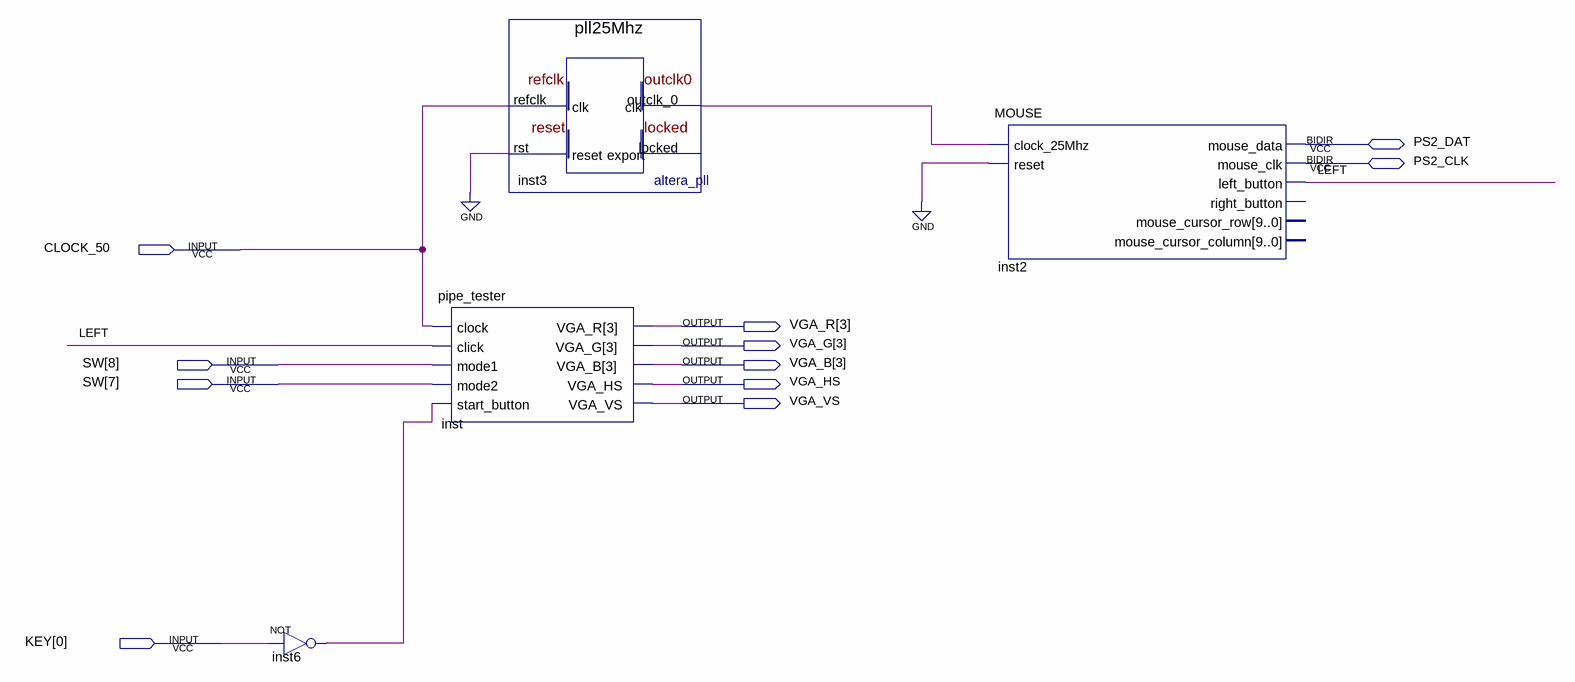
[diagram p0: schematic sheet]
// Quartus schematic test_playing.bdf as structural Verilog: 4 symbols, 11 pins
module test_playing (
  input  CLOCK_50,
  input  [8:7] SW,
  input  [0:0] KEY,
  inout  PS2_DAT,
  inout  PS2_CLK,
  output [3:3] VGA_R,
  output [3:3] VGA_G,
  output [3:3] VGA_B,
  output VGA_HS,
  output VGA_VS
);

  wire inst3_outclk_0, inst6_out, LEFT;

  not inst6 (inst6_out, KEY[0]);
  pipe_tester inst (
    .clock(CLOCK_50), .click(LEFT), .mode1(SW[8]), .mode2(SW[7]), .start_button(inst6_out), .VGA_R(VGA_R[3]),
    .VGA_G(VGA_G[3]), .VGA_B(VGA_B[3]), .VGA_HS(VGA_HS), .VGA_VS(VGA_VS));
  pll25Mhz inst3 (.refclk(CLOCK_50), .rst(1'b0), .outclk_0(inst3_outclk_0));  // open: locked
  MOUSE inst2 (
    .clock_25Mhz(inst3_outclk_0), .reset(1'b0), .left_button(LEFT), .mouse_data(PS2_DAT), .mouse_clk(PS2_CLK));  // open: right_button, mouse_cursor_row, mouse_cursor_column
endmodule
